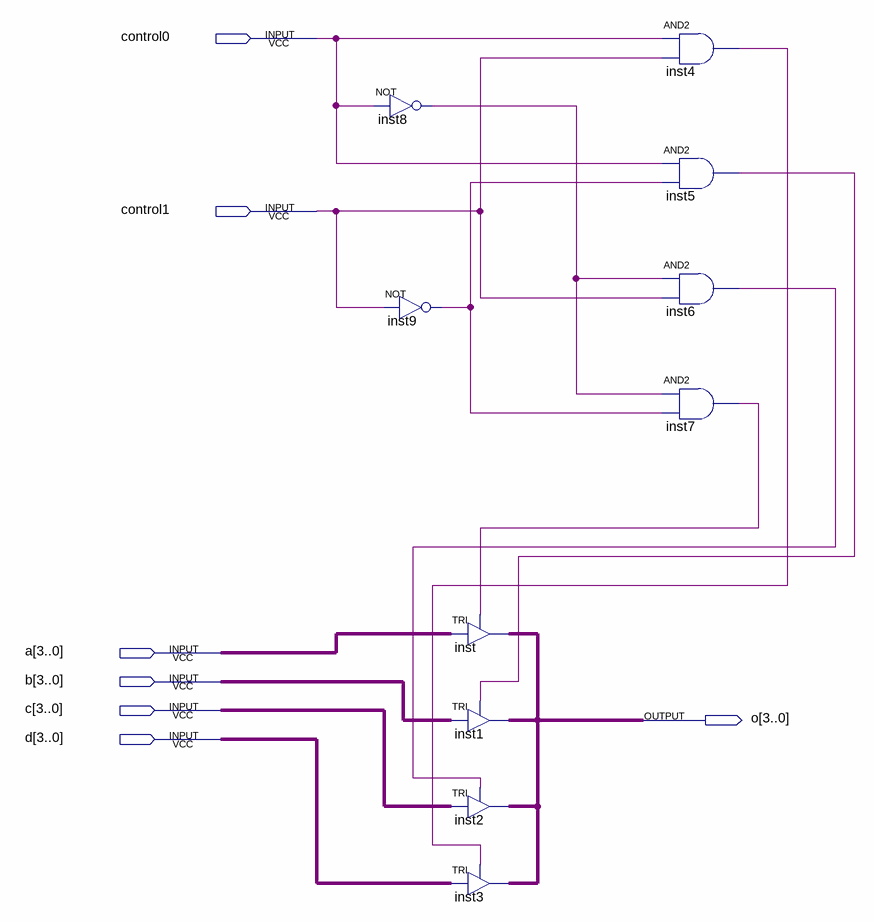
[diagram p0: schematic sheet]
// Quartus schematic muxbarula.bdf as structural Verilog: 10 symbols, 7 pins
module muxbarula (
  input  control0,
  input  control1,
  input  [3:0] a,
  input  [3:0] b,
  input  [3:0] c,
  input  [3:0] d,
  output [3:0] o
);

  wire inst4_out, inst5_out, inst6_out, inst7_out, inst8_out, inst9_out;

  not inst8 (inst8_out, control0);
  not inst9 (inst9_out, control1);
  TRI inst[3:0] (.IN(a), .OE(inst7_out), .OUT(o));
  TRI inst1[3:0] (.IN(b), .OE(inst5_out), .OUT(o));
  TRI inst2[3:0] (.IN(c), .OE(inst6_out), .OUT(o));
  TRI inst3[3:0] (.IN(d), .OE(inst4_out), .OUT(o));
  and inst4 (inst4_out, control0, control1);
  and inst5 (inst5_out, control0, inst9_out);
  and inst6 (inst6_out, inst8_out, control1);
  and inst7 (inst7_out, inst8_out, inst9_out);
endmodule
